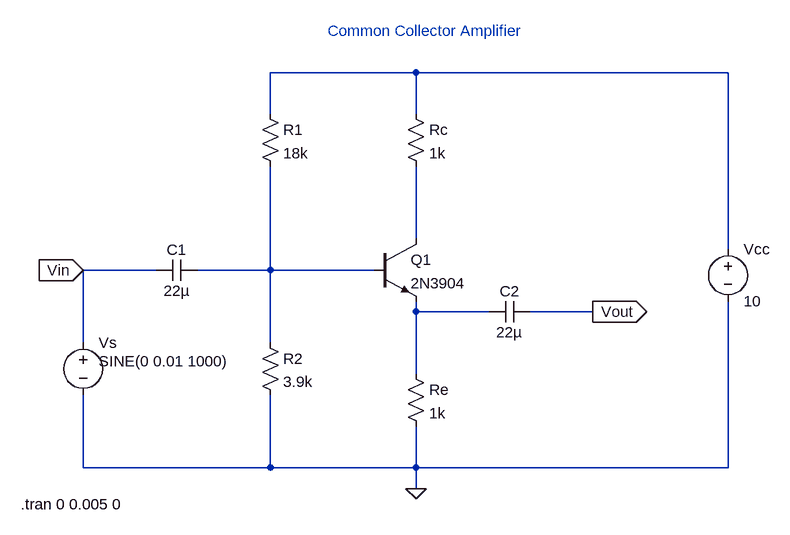
[diagram p0: schematic 2EEB_VELASCO_EXPT7_CKT4.asc]
2EEB_VELASCO_EXPT7_CKT4.asc, the LTspice schematic file:
Version 4
SHEET 1 880 680
WIRE 224 -128 0 -128
WIRE 704 -128 224 -128
WIRE 0 -64 0 -128
WIRE 224 -64 224 -128
WIRE 224 128 224 16
WIRE 704 144 704 -128
WIRE -176 176 -288 176
WIRE 0 176 0 16
WIRE 0 176 -112 176
WIRE 160 176 0 176
WIRE 224 240 224 224
WIRE 336 240 224 240
WIRE 496 240 400 240
WIRE -288 288 -288 176
WIRE 0 288 0 176
WIRE 224 336 224 240
WIRE -288 480 -288 368
WIRE 0 480 0 368
WIRE 0 480 -288 480
WIRE 224 480 224 416
WIRE 224 480 0 480
WIRE 704 480 704 224
WIRE 704 480 224 480
WIRE 224 512 224 480
FLAG 224 512 0
FLAG -288 176 Vin
IOPIN -288 176 In
FLAG 496 240 Vout
IOPIN 496 240 Out
SYMBOL npn 160 128 R0
SYMATTR InstName Q1
SYMATTR Value 2N3904
SYMBOL res 208 -80 R0
SYMATTR InstName Rc
SYMATTR Value 1k
SYMBOL res 208 320 R0
SYMATTR InstName Re
SYMATTR Value 1k
SYMBOL res -16 -80 R0
SYMATTR InstName R1
SYMATTR Value 18k
SYMBOL cap -112 160 R90
WINDOW 0 0 32 VBottom 2
WINDOW 3 32 32 VTop 2
SYMATTR InstName C1
SYMATTR Value 22µ
SYMBOL voltage -288 272 R0
WINDOW 3 24 44 Left 2
WINDOW 123 0 0 Left 0
WINDOW 39 0 0 Left 0
SYMATTR Value SINE(0 0.01 1000)
SYMATTR InstName Vs
SYMBOL res -16 272 R0
SYMATTR InstName R2
SYMATTR Value 3.9k
SYMBOL cap 400 224 R90
WINDOW 0 0 32 VBottom 2
WINDOW 3 32 32 VTop 2
SYMATTR InstName C2
SYMATTR Value 22µ
SYMBOL voltage 704 128 R0
WINDOW 123 0 0 Left 0
WINDOW 39 0 0 Left 0
SYMATTR InstName Vcc
SYMATTR Value 10
TEXT 88 -192 Left 2 ;Common Collector Amplifier
TEXT -384 536 Left 2 !.tran 0 0.005 0

The netlist it stands for:
* 2EEB_VELASCO_EXPT7_CKT4.asc
Q1 N002 N003 N004 0 2N3904
Rc N001 N002 1k
Re N004 0 1k
R1 N001 N003 18k
C1 N003 Vin 22µ
Vs Vin 0 SINE(0 0.01 1000)
R2 N003 0 3.9k
C2 Vout N004 22µ
Vcc N001 0 10
.model NPN NPN
.model PNP PNP
.lib standard.bjt
* Common Collector Amplifier
.tran 0 0.005 0
.backanno
.end